# EAGLE schematic main (EAGLE 8.2.2)
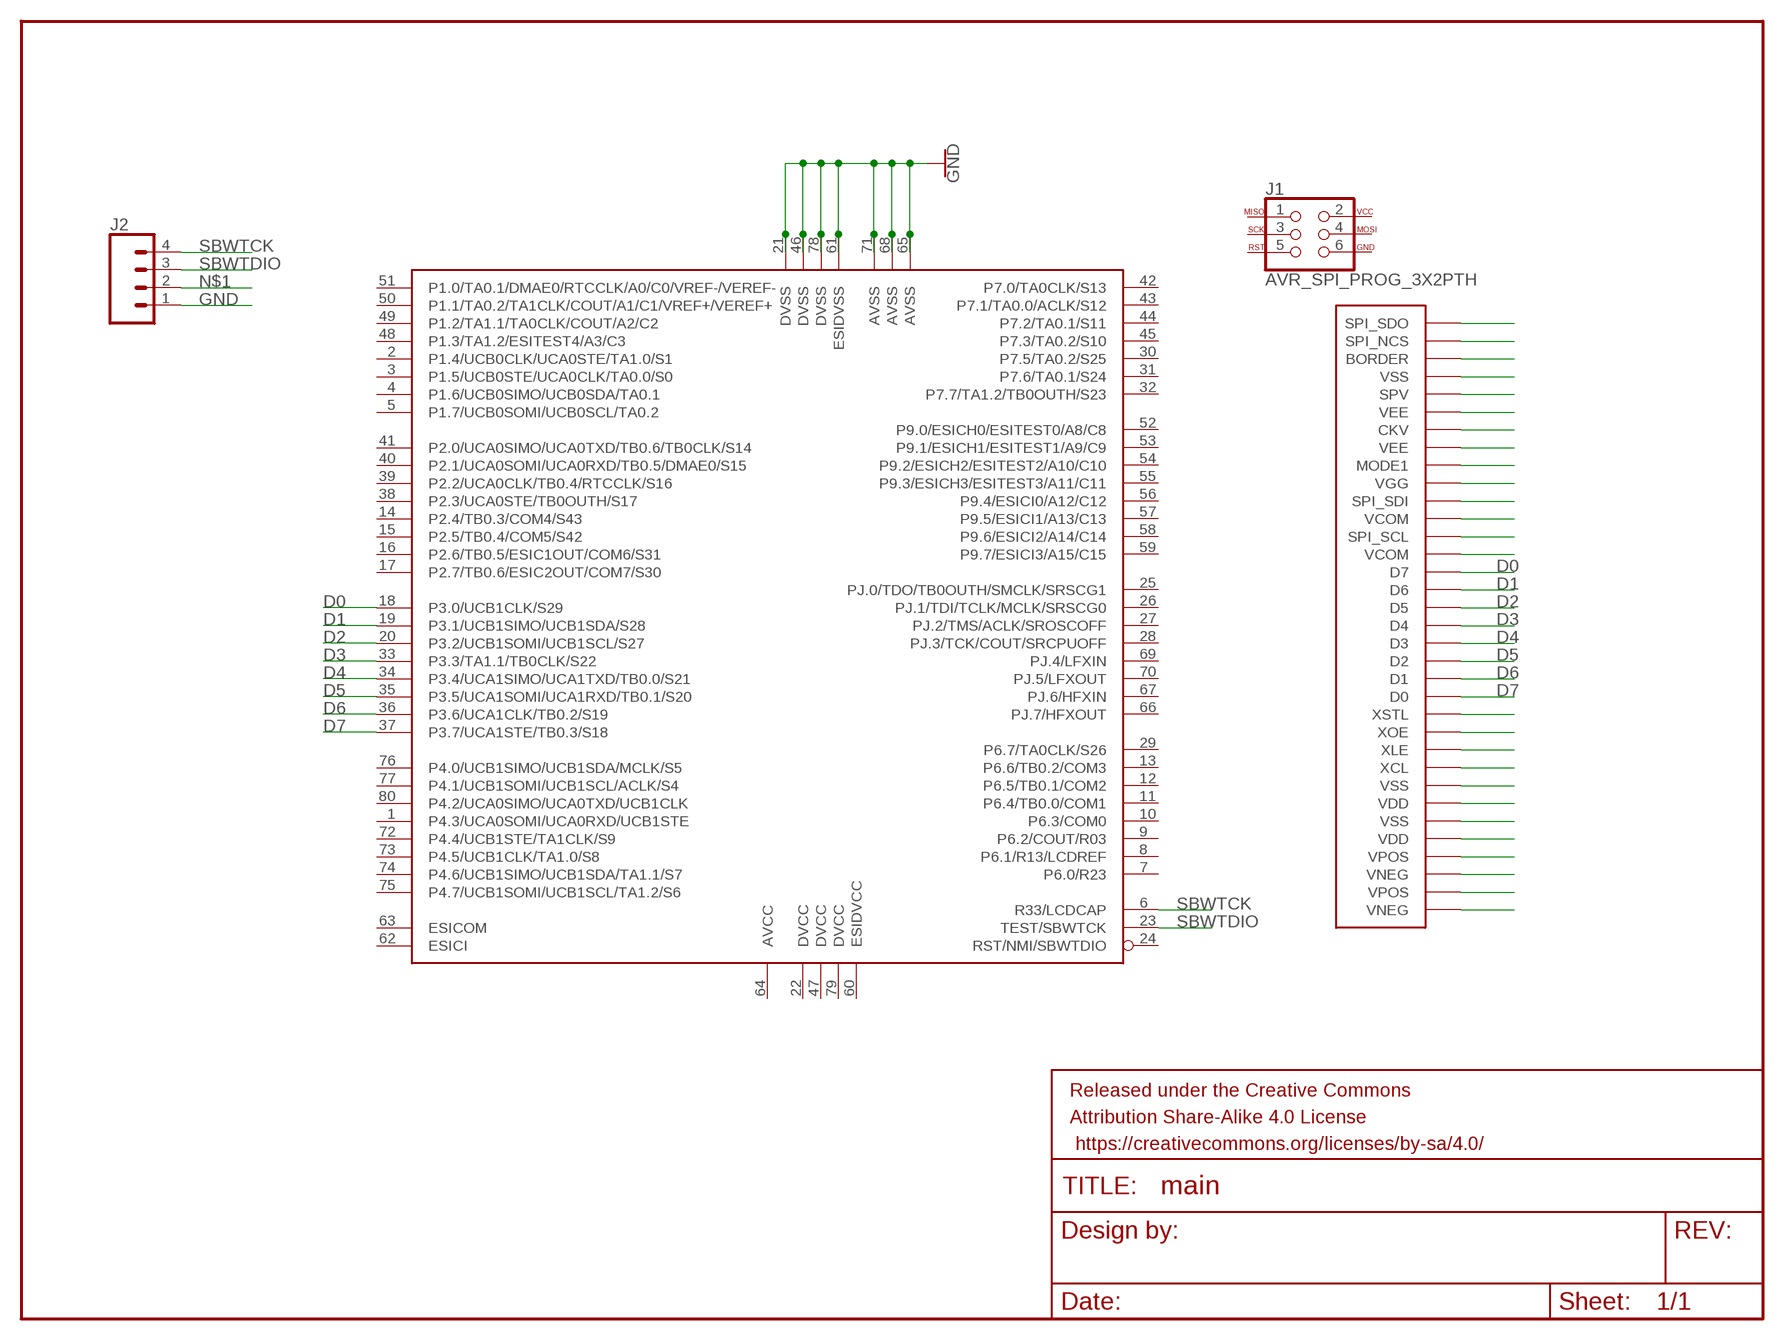
[diagram p0: schematic, sheet 1]

## Parts
FRAME1  FRAME-LETTER  [CREATIVE_COMMONS]
J1  AVR_SPI_PROG_3X2PTH  [2X3]
J2  CONN_04  [1X04]
U$1  MSP430FR698X  [LQFP-80]
U$2  ED060SC7(IF)  [AXT334124]

## Nets
D0: U$1.18(P3.0/UCB1CLK/S29) U$2.20(D7)
D1: U$1.19(P3.1/UCB1SIMO/UCB1SDA/S28) U$2.19(D6)
D2: U$1.20(P3.2/UCB1SOMI/UCB1SCL/S27) U$2.18(D5)
D3: U$1.33(P3.3/TA1.1/TB0CLK/S22) U$2.17(D4)
D4: U$1.34(P3.4/UCA1SIMO/UCA1TXD/TB0.0/S21) U$2.16(D3)
D5: U$1.35(P3.5/UCA1SOMI/UCA1RXD/TB0.1/S20) U$2.15(D2)
D6: U$1.36(P3.6/UCA1CLK/TB0.2/S19) U$2.14(D1)
D7: U$1.37(P3.7/UCA1STE/TB0.3/S18) U$2.13(D0)
GND: J2.1 U$1.21(DVSS) U$1.46(DVSS) U$1.61(ESIDVSS) U$1.65(AVSS) U$1.68(AVSS) U$1.71(AVSS) U$1.78(DVSS)
N$1: J2.2
N$2: U$2.34(SPI_SDO)
N$3: U$2.33(SPI_NCS)
N$4: U$2.32(BORDER)
N$5: U$2.31(VSS)
N$6: U$2.30(SPV)
N$7: U$2.29(VEE)
N$8: U$2.28(CKV)
N$9: U$2.27(VEE)
N$10: U$2.26(MODE1)
N$11: U$2.25(VGG)
N$12: U$2.24(SPI_SDI)
N$13: U$2.23(VCOM)
N$14: U$2.22(SPI_SCL)
N$15: U$2.21(VCOM)
N$16: U$2.12(XSTL)
N$17: U$2.11(XOE)
N$18: U$2.10(XLE)
N$19: U$2.9(XCL)
N$20: U$2.8(VSS)
N$21: U$2.7(VDD)
N$22: U$2.6(VSS)
N$23: U$2.5(VDD)
N$24: U$2.4(VPOS)
N$25: U$2.3(VNEG)
N$26: U$2.2(VPOS)
N$27: U$2.1(VNEG)
SBWTCK: J2.4 U$1.6(R33/LCDCAP)
SBWTDIO: J2.3 U$1.23(TEST/SBWTCK)
Unconnected: J1.1 J1.2 J1.3 J1.4 J1.5 J1.6 U$1.1(P4.3/UCA0SOMI/UCA0RXD/UCB1STE) U$1.2(P1.4/UCB0CLK/UCA0STE/TA1.0/S1) U$1.3(P1.5/UCB0STE/UCA0CLK/TA0.0/S0) U$1.4(P1.6/UCB0SIMO/UCB0SDA/TA0.1) U$1.5(P1.7/UCB0SOMI/UCB0SCL/TA0.2) U$1.7(P6.0/R23) U$1.8(P6.1/R13/LCDREF) U$1.9(P6.2/COUT/R03) U$1.10(P6.3/COM0) U$1.11(P6.4/TB0.0/COM1) U$1.12(P6.5/TB0.1/COM2) U$1.13(P6.6/TB0.2/COM3) U$1.14(P2.4/TB0.3/COM4/S43) U$1.15(P2.5/TB0.4/COM5/S42) U$1.16(P2.6/TB0.5/ESIC1OUT/COM6/S31) U$1.17(P2.7/TB0.6/ESIC2OUT/COM7/S30) U$1.24(RST/NMI/SBWTDIO) U$1.25(PJ.0/TDO/TB0OUTH/SMCLK/SRSCG1) U$1.26(PJ.1/TDI/TCLK/MCLK/SRSCG0) U$1.27(PJ.2/TMS/ACLK/SROSCOFF) U$1.28(PJ.3/TCK/COUT/SRCPUOFF) U$1.29(P6.7/TA0CLK/S26) U$1.30(P7.5/TA0.2/S25) U$1.31(P7.6/TA0.1/S24) U$1.32(P7.7/TA1.2/TB0OUTH/S23) U$1.38(P2.3/UCA0STE/TB0OUTH/S17) U$1.39(P2.2/UCA0CLK/TB0.4/RTCCLK/S16) U$1.40(P2.1/UCA0SOMI/UCA0RXD/TB0.5/DMAE0/S15) U$1.41(P2.0/UCA0SIMO/UCA0TXD/TB0.6/TB0CLK/S14) U$1.42(P7.0/TA0CLK/S13) U$1.43(P7.1/TA0.0/ACLK/S12) U$1.44(P7.2/TA0.1/S11) U$1.45(P7.3/TA0.2/S10) U$1.48(P1.3/TA1.2/ESITEST4/A3/C3) U$1.49(P1.2/TA1.1/TA0CLK/COUT/A2/C2) U$1.50(P1.1/TA0.2/TA1CLK/COUT/A1/C1/VREF+/VEREF+) U$1.51(P1.0/TA0.1/DMAE0/RTCCLK/A0/C0/VREF-/VEREF-) U$1.52(P9.0/ESICH0/ESITEST0/A8/C8) U$1.53(P9.1/ESICH1/ESITEST1/A9/C9) U$1.54(P9.2/ESICH2/ESITEST2/A10/C10) U$1.55(P9.3/ESICH3/ESITEST3/A11/C11) U$1.56(P9.4/ESICI0/A12/C12) U$1.57(P9.5/ESICI1/A13/C13) U$1.58(P9.6/ESICI2/A14/C14) U$1.59(P9.7/ESICI3/A15/C15) U$1.62(ESICI) U$1.63(ESICOM) U$1.64(AVCC) U$1.66(PJ.7/HFXOUT) U$1.67(PJ.6/HFXIN) U$1.69(PJ.4/LFXIN) U$1.70(PJ.5/LFXOUT) U$1.72(P4.4/UCB1STE/TA1CLK/S9) U$1.73(P4.5/UCB1CLK/TA1.0/S8) U$1.74(P4.6/UCB1SIMO/UCB1SDA/TA1.1/S7) U$1.75(P4.7/UCB1SOMI/UCB1SCL/TA1.2/S6) U$1.76(P4.0/UCB1SIMO/UCB1SDA/MCLK/S5) U$1.77(P4.1/UCB1SOMI/UCB1SCL/ACLK/S4) U$1.80(P4.2/UCA0SIMO/UCA0TXD/UCB1CLK)

## Power pins joined to a net without a drawn wire
DVCC: U$1.22(DVCC) U$1.47(DVCC) U$1.79(DVCC)
ESIDVCC: U$1.60(ESIDVCC)

## Library data of the parts
FRAME1 = SparkFun-Aesthetics:FRAME-LETTER: Schematic Frame - Letter Standard 8.5x11 US Letter frame
J1 = SparkFun-Connectors:AVR_SPI_PROG_3X2: AVR ISP 6 Pin This is the reduced ISP connector for AVR programming. Common on Arduino. This footprint will take up less PCB space and can be used with a 10-pin to 6-pin adapter such as SKU: BOB-08508 **Special note about "TEST_POINT" package. The stop mask is on the top side, so if you want your programming test points to be on the bottom of your board, make sure to place this package on the bottom side of the board. This also ensure that the orientation to program from the bottom side will be correct. SparkFun Products: SparkFun ISP Pogo Adapter <https://www.sparkfun.com/products/11591> - NS Tiny AVR Programmer <https://www.sparkfun.com/products/11801> -PTH
J2 = SparkFun-Connectors:CONN_04: Multi connection point. Often used as Generic Header-pin footprint for 0.1 inch spaced/style header connections On any of the 0.1 inch spaced packages, you can populate with these: Break Away Headers - Straight <https://www.sparkfun.com/products/116> (PRT-00116) Break Away Male Headers - Right Angle <https://www.sparkfun.com/products/553> (PRT-00553) Female Headers <https://www.sparkfun.com/products/115> (PRT-00115) Break Away Headers - Machine Pin <https://www.sparkfun.com/products/117> (PRT-00117) Break Away Female Headers - Swiss Machine Pin <https://www.sparkfun.com/products/743> (PRT-00743) For SCREWTERMINALS and SPRING TERMINALS visit here: Screw Terimnals on SparkFun.com <https://www.sparkfun.com/search/results?term=Screw+Terminals> (5mm/3.5mm/2.54mm spacing) This device is also useful as a general connection point to wire up your design to another part of your project. Our various solder wires solder well into these plated through hole pads. Hook-Up Wire - Assortment (Stranded, 22 AWG) <https://www.sparkfun.com/products/11375> (PRT-11375) Hook-Up Wire - Assortment (Solid Core, 22 AWG) <https://www.sparkfun.com/products/11367> (PRT-11367) View the entire wire category on our website here <https://www.sparkfun.com/categories/141> Special notes: Molex polarized connector foot print use with SKU : PRT-08231 with associated crimp pins and housings. 1MM SMD Version SKU: PRT-10208; PROD_ID: CONN-09696
U$1 = MyLibrary - Microcontroller:MSP430FR698X
U$2 = MyLibrary - Connectors:ED060SC7(IF): ATX334124 socket to connect with the ATX424124 header on the ED060SC7 E-ink LCD